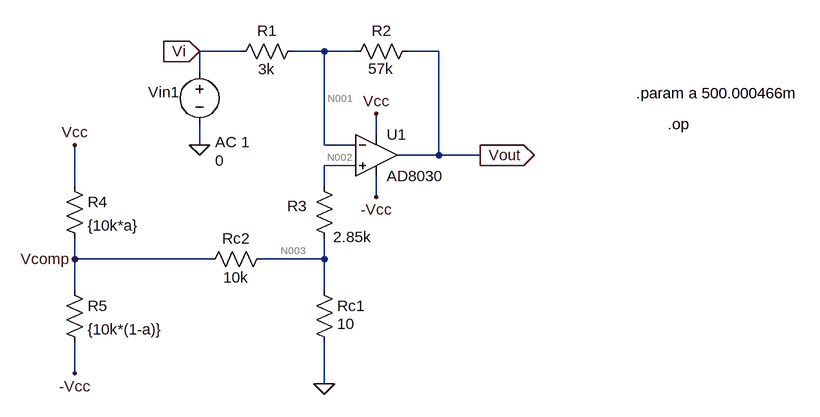
[diagram p0: schematic ETAJ1.asc]
ETAJ1.asc, the LTspice schematic file:
Version 4
SHEET 1 960 680
WIRE 80 -160 16 -160
WIRE 208 -160 160 -160
WIRE 256 -160 208 -160
WIRE 384 -160 336 -160
WIRE 16 -128 16 -160
WIRE 288 -32 288 -64
WIRE 16 -16 16 -48
WIRE 208 -16 208 -160
WIRE 256 -16 208 -16
WIRE 384 0 384 -160
WIRE 384 0 320 0
WIRE 448 0 384 0
WIRE 256 16 208 16
WIRE -176 48 -176 -16
WIRE 208 48 208 16
WIRE 288 64 288 32
WIRE -176 160 -176 128
WIRE 32 160 -176 160
WIRE 208 160 208 128
WIRE 208 160 112 160
WIRE -176 208 -176 160
WIRE 208 208 208 160
WIRE -176 336 -176 288
WIRE 208 352 208 288
FLAG 208 352 0
FLAG 16 -16 0
FLAG 288 -64 Vcc
FLAG 288 64 -Vcc
FLAG -176 -16 Vcc
FLAG -176 336 -Vcc
FLAG 448 0 Vout
IOPIN 448 0 Out
FLAG -176 160 Vcomp
FLAG 16 -160 Vi
IOPIN 16 -160 In
SYMBOL OpAmps\\AD8030 288 -64 R0
SYMATTR InstName U1
SYMBOL res 176 -176 R90
WINDOW 0 0 56 VBottom 2
WINDOW 3 59 57 VBottom 2
SYMATTR InstName R1
SYMATTR Value 3k
SYMBOL res 352 -176 R90
WINDOW 0 0 56 VBottom 2
WINDOW 3 58 57 VBottom 2
SYMATTR InstName R2
SYMATTR Value 57k
SYMBOL res 192 32 R0
WINDOW 0 -41 46 Left 2
WINDOW 3 30 94 Left 2
SYMATTR InstName R3
SYMATTR Value 2.85k
SYMBOL res 192 192 R0
WINDOW 3 36 68 Left 2
SYMATTR Value 10
SYMATTR InstName Rc1
SYMBOL res 128 144 R90
WINDOW 0 0 56 VBottom 2
WINDOW 3 60 56 VBottom 2
SYMATTR InstName Rc2
SYMATTR Value 10k
SYMBOL voltage 16 -144 R0
WINDOW 0 -79 47 Left 2
WINDOW 3 24 152 Left 2
WINDOW 123 24 124 Left 2
WINDOW 39 0 0 Left 0
SYMATTR InstName Vin1
SYMATTR Value 0
SYMATTR Value2 AC 1
SYMBOL res -192 32 R0
SYMATTR InstName R4
SYMATTR Value {10k*a}
SYMBOL res -192 192 R0
SYMATTR InstName R5
SYMATTR Value {10k*(1-a)}
TEXT 688 -96 Left 2 !.param a 500.000466m
TEXT 736 -48 Left 2 !.op

The netlist it stands for:
* ETAJ1.asc
XU1 N002 N001 Vcc -Vcc Vout AD8040  ; AD8030, pins In+ In- V+ V- OUT
R1 N001 Vi 3k
R2 Vout N001 57k
R3 N002 N003 2.85k
Rc1 N003 0 10
Rc2 N003 Vcomp 10k
Vin1 Vi 0 0 AC 1
R4 Vcc Vcomp {10k*a}
R5 Vcomp -Vcc {10k*(1-a)}
.param a 500.000466m
.op
.lib ADI.lib
.backanno
.end

* Results of the author's LTspice run, read from the files saved beside the schematic
* Operating Point:
*   V(vcc) = 29.07 mV
*   V(-vcc) = -919.1 µV
*   V(n001) = -1.285 mV
*   V(n002) = -1.983 mV
*   V(vout) = 14.06 mV
*   V(vi) = 0 V
*   V(n003) = 4.282 µV
*   V(vcomp) = 11.26 mV
*   I(R5) = 2.436 µA
*   I(R4) = 3.561 µA
*   I(Rc2) = -1.126 µA
*   I(Rc1) = 428.2 nA
*   I(R3) = -697.3 nA
*   I(R2) = 269.2 nA
*   I(R1) = -428.2 nA
*   I(Vin1) = -428.2 nA
*   Ix(u1:1) = 697.3 nA
*   Ix(u1:2) = 697.4 nA
*   Ix(u1:3) = -3.587 µA
*   Ix(u1:4) = 2.457 µA
*   Ix(u1:5) = -269.2 nA
* From the log:
*   Semiconductor Device Operating Points:
*                           --- Diodes ---
*   Name:    d:u1:2      d:u1:8      d:u1:1      d:u1:7      d:u1:4
*   Model:    u1:bb      u1:ed2       u1:aa      u1:bias     u1:bias
*   Id:     -1.08e-17    6.99e-16   -2.69e-07   -7.00e-07   -7.00e-07
*   Vd:     -1.08e-05    6.99e-04   -1.08e-05    3.10e-02    3.04e-02
*   Req:     1.00e-12    1.00e-12    2.50e-02    2.00e-05    2.00e-05
*   CAP:     0.00e+00    0.00e+00    0.00e+00    0.00e+00    0.00e+00
*   Name:    d:u1:3      d:u1:6      d:u1:5      d:u1:22     d:u1:21
*   Model:    u1:iq       u1:x1       u1:x1      u1:esd      u1:esd
*   Id:      3.95e-07    2.85e-06    2.59e-06   -1.50e-14   -1.50e-14
*   Vd:      3.00e-02   -1.50e-02   -1.50e-02   -1.50e-02   -1.50e-02
*   Req:     1.00e-03    1.00e+03    1.00e+03    1.00e-12    1.00e-12
*   CAP:     0.00e+00    0.00e+00    0.00e+00    0.00e+00    0.00e+00